# EAGLE design ProMini_İnişTakımı (EAGLE 9.6.2)
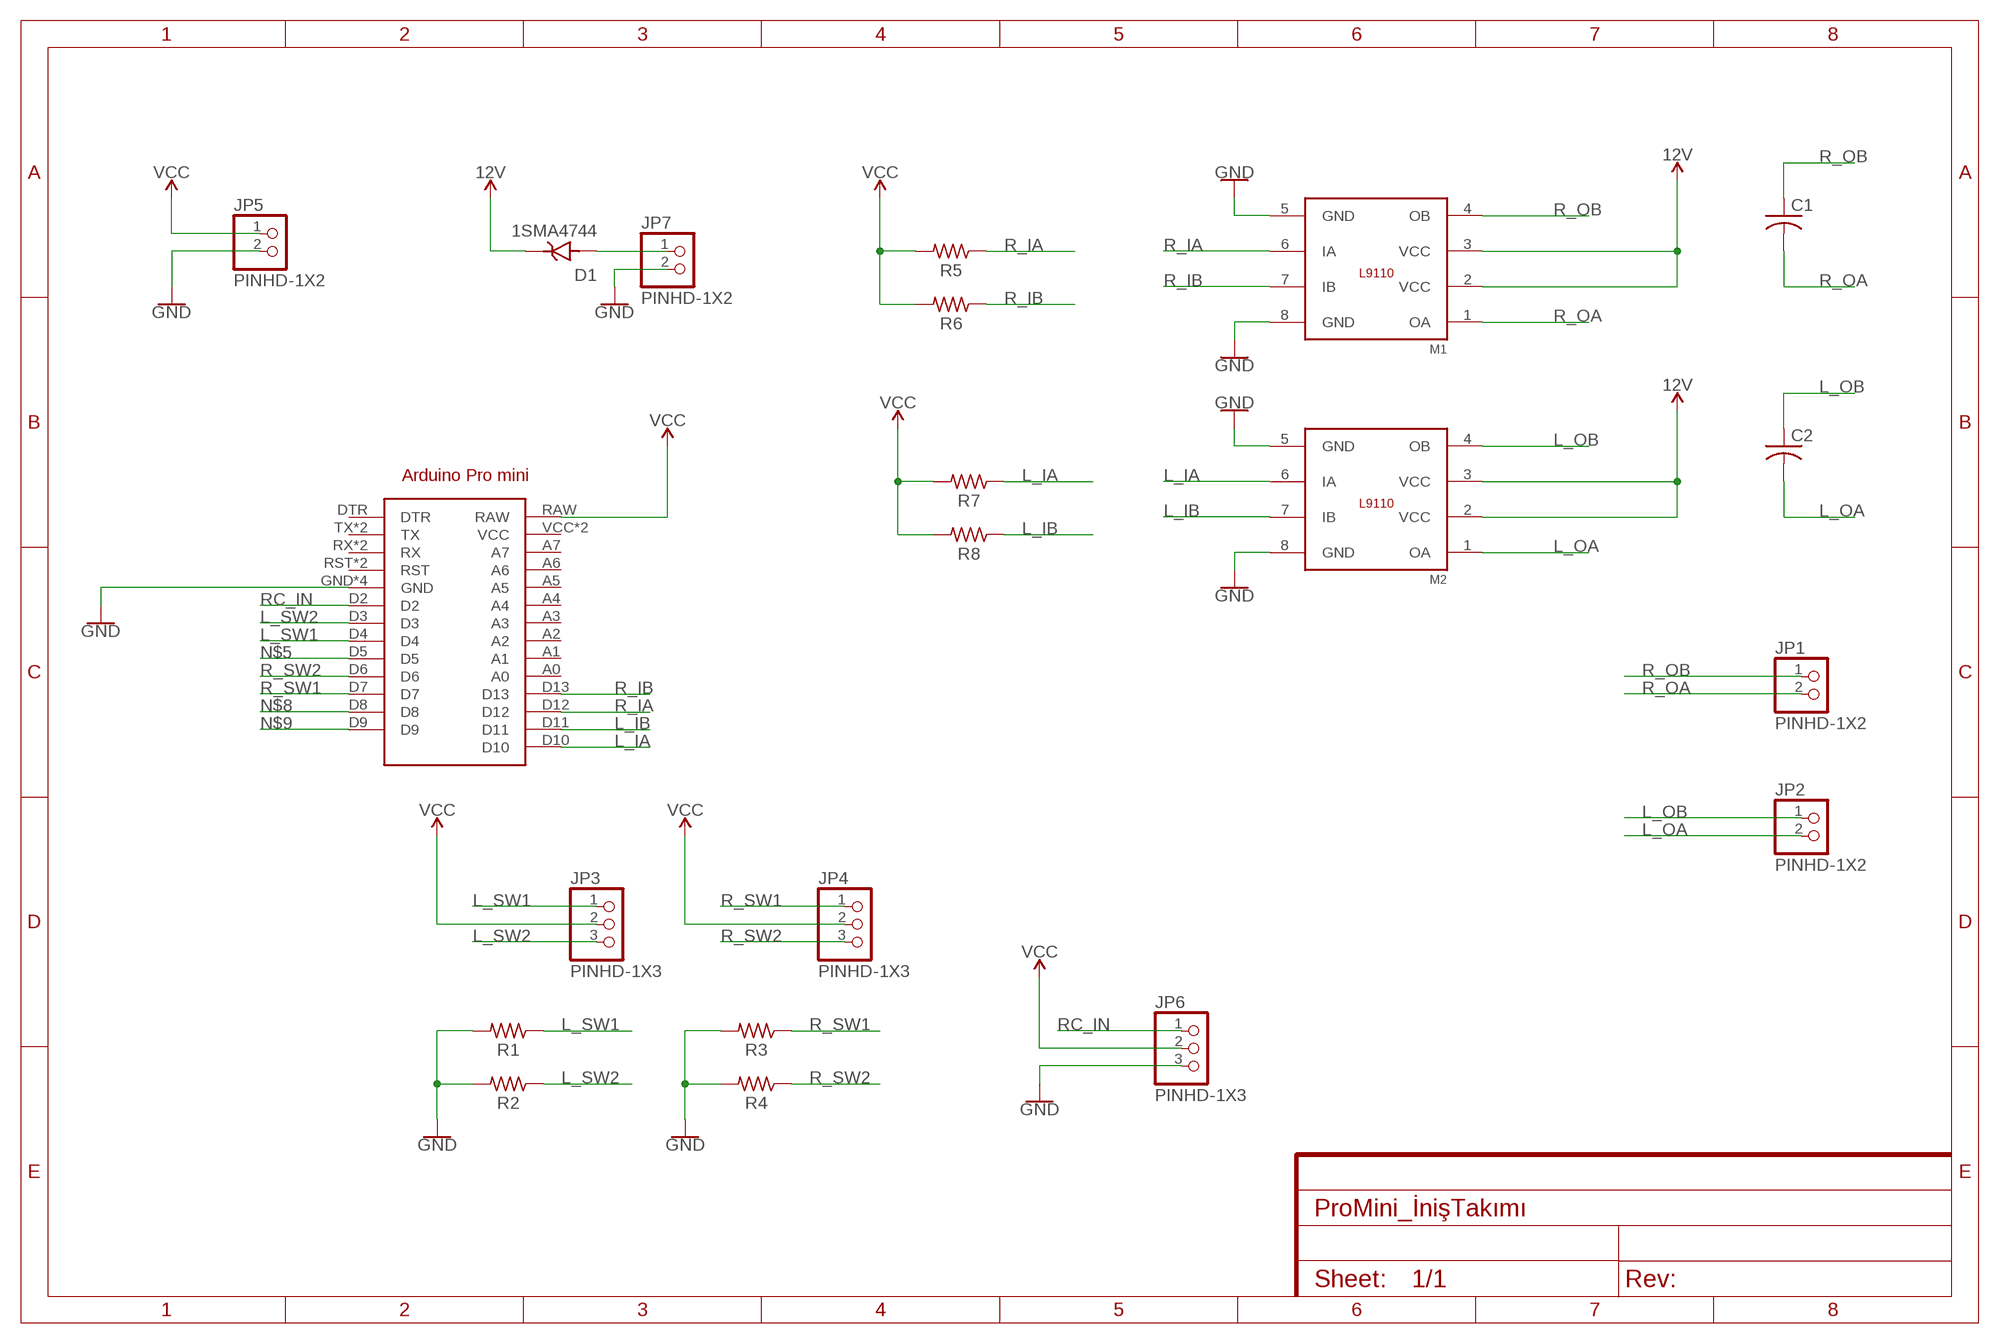
[diagram p0: schematic, sheet 1]

## Parts
ARDUINO1  ARDUINO_PRO_MINI  [ARDUINO_PRO_MINI]
C1  C-US_CHIP-0805(2012-METRIC)  [CAPC2012X110]
C2  C-US_CHIP-0805(2012-METRIC)  [CAPC2012X110]
D1  1SMA4744  [DIOM4325X250N]
JP1  PINHD-1X2  [1X02]
JP2  PINHD-1X2  [1X02]
JP3  PINHD-1X3  [1X03]
JP4  PINHD-1X3  [1X03]
JP5  PINHD-1X2  [1X02]
JP6  PINHD-1X3  [1X03]
JP7  PINHD-1X2  [1X02]
M1  L9110  [SO8P]
M2  L9110  [SO8P]
R1  R-US_CHIP-0805(2012-METRIC)  [RESC2012X65]
R2  R-US_CHIP-0805(2012-METRIC)  [RESC2012X65]
R3  R-US_CHIP-0805(2012-METRIC)  [RESC2012X65]
R4  R-US_CHIP-0805(2012-METRIC)  [RESC2012X65]
R5  R-US_CHIP-0805(2012-METRIC)  [RESC2012X65]
R6  R-US_CHIP-0805(2012-METRIC)  [RESC2012X65]
R7  R-US_CHIP-0805(2012-METRIC)  [RESC2012X65]
R8  R-US_CHIP-0805(2012-METRIC)  [RESC2012X65]

## Nets
12V: D1.C(K) M1.2(VCC) M1.3(VCC) M2.2(VCC) M2.3(VCC)
GND: ARDUINO1.GND ARDUINO1.GND@1(GND) ARDUINO1.GND@2(GND) ARDUINO1.GND@3(GND) JP5.2 JP6.3 JP7.2 M1.5(GND) M1.8(GND) M2.5(GND) M2.8(GND) R1.2 R2.2 R3.2 R4.2
L_IA: ARDUINO1.D10 M2.6(IA) R7.1
L_IB: ARDUINO1.D11 M2.7(IB) R8.1
L_OA: C2.2 JP2.2 M2.1(OA)
L_OB: C2.1 JP2.1 M2.4(OB)
L_SW1: ARDUINO1.D4 JP3.1 R1.1
L_SW2: ARDUINO1.D3 JP3.3 R2.1
N$1: D1.A JP7.1
N$5: ARDUINO1.D5
N$8: ARDUINO1.D8
N$9: ARDUINO1.D9
R_IA: ARDUINO1.D12 M1.6(IA) R5.1
R_IB: ARDUINO1.D13 M1.7(IB) R6.1
R_OA: C1.2 JP1.2 M1.1(OA)
R_OB: C1.1 JP1.1 M1.4(OB)
R_SW1: ARDUINO1.D7 JP4.1 R3.1
R_SW2: ARDUINO1.D6 JP4.3 R4.1
RC_IN: ARDUINO1.D2 JP6.1
VCC: ARDUINO1.RAW JP3.2 JP4.2 JP5.1 JP6.2 R5.2 R6.2 R7.2 R8.2
Unconnected: ARDUINO1.A0 ARDUINO1.A1 ARDUINO1.A2 ARDUINO1.A3 ARDUINO1.A4 ARDUINO1.A5 ARDUINO1.A6 ARDUINO1.A7 ARDUINO1.DTR ARDUINO1.RST ARDUINO1.RST@1(RST) ARDUINO1.RX ARDUINO1.RX@1(RX) ARDUINO1.TX ARDUINO1.TX@1(TX)

## Power pins joined to a net without a drawn wire
VCC: ARDUINO1.VCC ARDUINO1.VCC@1(VCC)

## Library data of the parts
ARDUINO1 = arduinopromini:ARDUINO_PRO_MINI: For creating Arduino Pro Mini shields
C1 C2 = Capacitor:C-US: Capacitor - ANSI; CATEGORY: Capacitor
D1 = 1SMA4744:1SMA4744: Check availability <https://pricing.snapeda.com/parts/1SMA4744/Taiwan%20Semiconductor/view-part?ref=eda>; AVAILABILITY: In Stock; DESCRIPTION: DO-214AC (SMA), 1250mW, 5%, Zener Diode; MF: Taiwan Semiconductor; MP: 1SMA4744; PACKAGE: SMA-2 Taiwan Semiconductor; PRICE: None; PURCHASE-URL: https://pricing.snapeda.com/search/part/1SMA4744/?ref=eda
JP1 JP2 JP5 JP7 = Connector:PINHD-1X2: PIN HEADER; CATEGORY: CONNECTOR; SUB-CATEGORY: PIN-HEADER
JP3 JP4 JP6 = Connector:PINHD-1X3: PIN HEADER; CATEGORY: CONNECTOR; SUB-CATEGORY: PIN-HEADER
M1 M2 = l9110:L9110
R1-R8 = Resistor:R-US: Resistor Fixed - ANSI; CATEGORY: Resistor; SUB-CATEGORY: Fixed

## Board
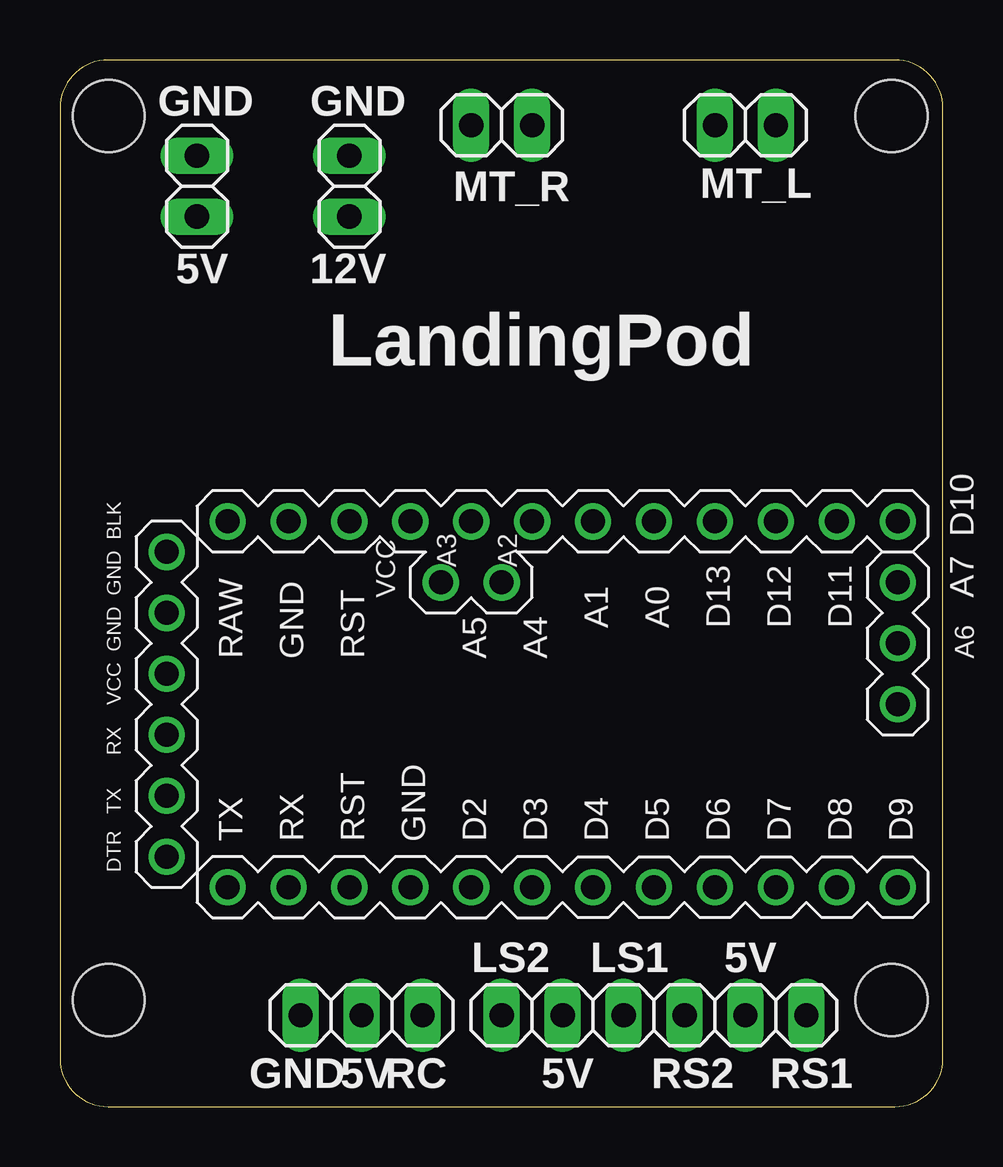
[diagram p1: board, top side]
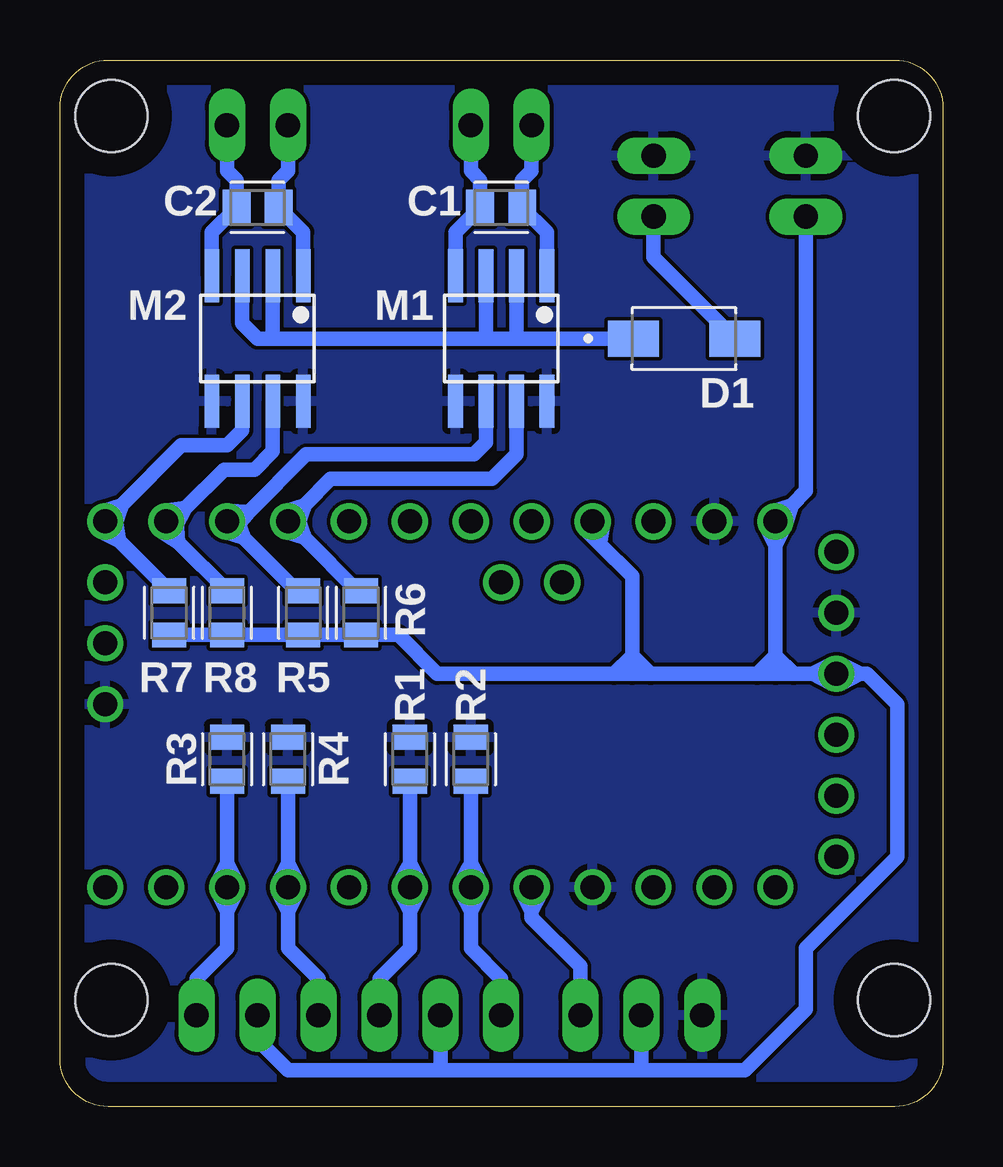
[diagram p2: board, bottom side, seen from below]

Size 36.81 x 43.61 mm. Coordinates in mm from the lower left corner, seen from the top.
Outline: 0,41.61 0,2 arc90 2,0 34.81,0 arc90 36.81,2 36.81,41.61 arc90 34.81,43.61 2,43.61 arc90 0,41.61
Copper layers (1*16): Top 0.035mm / dielectric 1.5mm / Bottom 0.035mm
Design rules "default": minimum track width 6mil, minimum drill 0.35mm, track to track 6mil, track to pad 6mil, pad to pad 6mil, via to via 6mil, smd to smd 6mil, copper to edge 40mil, drill to drill 6mil, minimum pad ring 10mil, minimum via ring 8mil, stop-mask expansion 4mil, vias tented up to drill 0mil, thermal gap 10mil
Holes 3 mm at 2.03,4.45 34.67,41.27 2.03,41.27 34.67,4.45

### Footprints (pad centres in the part's own frame; a part is rotated, then mirrored left to right if it is on the bottom)
ARDUINO_PRO_MINI = drill 1: A0 11.43,-8.89; A1 11.43,-6.35; A2 11.43,-3.81; A3 11.43,-1.27; A4 8.89,-2.54; A5 8.89,0; A6 6.35,-19.05; A7 8.89,-19.05; BLK 10.16,11.43; D2 -3.81,-1.27; D3 -3.81,-3.81; D4 -3.81,-6.35; D5 -3.81,-8.89; D6 -3.81,-11.43; D7 -3.81,-13.97; D8 -3.81,-16.51; D9 -3.81,-19.05; D10 11.43,-19.05; D11 11.43,-16.51; D12 11.43,-13.97; D13 11.43,-11.43; DTR -2.54,11.43; GND -3.81,1.27; GND@1 11.43,6.35; GND@2 7.62,11.43; GND@3 3.81,-19.05; RAW 11.43,8.89; RST 11.43,3.81; RST@1 -3.81,3.81; RX -3.81,6.35; RX@1 2.54,11.43; TX -3.81,8.89; TX@1 0,11.43; VCC 11.43,1.27; VCC@1 5.08,11.43
CAPC2012X110 = smd 1.165 x 1.465: 1 -0.875,0; 2 0.875,0
DIOM4325X250N = smd 2.12 x 1.5: A 2.115,0; C -2.115,0
1X02 = drill 1.016 long: 1 -1.27,0; 2 1.27,0
1X03 = drill 1.016 long: 1 -2.54,0; 2 0,0; 3 2.54,0
SO8P = smd 0.61 x 2.21: 1 -1.905,-2.616; 2 -0.635,-2.616; 3 0.635,-2.616; 4 1.905,-2.616; 5 1.905,2.616; 6 0.635,2.616; 7 -0.635,2.616; 8 -1.905,2.616
RESC2012X65 = smd 1.031 x 1.42: 1 -0.919,0; 2 0.919,0

### Placement (x,y rotation side)
ARDUINO1  15.88,12.95 90 top
C1  18.41,37.46 0 bottom
C2  28.58,37.46 0 bottom
D1  10.79,32 0 bottom
JP1  18.41,40.89 180 top
JP2  28.58,40.89 180 top
JP3  20.95,3.81 180 top
JP4  28.58,3.81 180 top
JP5  5.71,38.35 90 top
JP6  12.57,3.81 180 top
JP7  12.06,38.35 90 top
M1  18.41,32 180 bottom
M2  28.58,32 180 bottom
R1  22.22,14.48 90 bottom
R2  19.68,14.48 90 bottom
R3  29.84,14.48 90 bottom
R4  27.3,14.48 90 bottom
R5  26.67,20.57 270 bottom
R6  24.26,20.57 270 bottom
R7  32.26,20.57 270 bottom
R8  29.84,20.57 270 bottom

### Tracks (layer width: path | path; a pad name or v marks a point on that pad's centre or on a via)
12V
  Bottom 0.61: D1.C 17.78,32 | 17.78,32 19.18,32 | 19.18,32 27.94,32 | 27.94,32 28.58,32 29.21,32.64 M2.3 | M2.2 27.94,32 | M1.3 19.05,32.13 19.18,32 | M1.2 17.78,32
GND
  pour Bottom: 0.63,48.51 42.55,48.51 42.55,-6.1 -3.18,-6.1 -3.18,2.79 -3.18,48.51
L_IA
  Bottom 0.61: R7.1 34.34,23.57 | 34.34,23.57 34.92,24.16 ARDUINO1.D10 | ARDUINO1.D10 34.22,25.09 | 34.22,25.09 31.75,27.56 29.84,27.56 29.21,28.19 M2.6 | 34.34,23.57 35.13,23.99 ARDUINO1.D10 | 34.34,23.57 34.48,24.46 ARDUINO1.D10 | 34.22,25.09 34.5,24.24 ARDUINO1.D10 | 34.22,25.09 35.07,24.81 ARDUINO1.D10
L_IB
  Bottom 0.61: R8.1 31.88,23.52 | 31.88,23.52 32.38,24.03 ARDUINO1.D11 | ARDUINO1.D11 32.13,24.38 31.56,24.95 | 31.56,24.95 29.97,26.54 28.7,26.54 27.94,27.3 M2.7 | 31.88,23.52 32.63,24.01 ARDUINO1.D11 | 31.88,23.52 31.94,24.41 ARDUINO1.D11 | 31.56,24.95 31.99,24.17 ARDUINO1.D11 | 31.56,24.95 32.45,24.83 ARDUINO1.D11
L_OA
  Bottom 0.61: JP2.2 27.3,38.99 27.7,38.59 C2.2 26.67,36.44 M2.1
L_OB
  Bottom 0.61: JP2.1 29.84,38.99 29.45,38.59 C2.1 30.48,36.44 M2.4
L_SW1
  Bottom 0.61: R1.1 22.22,10.14 | 22.22,10.14 ARDUINO1.D4 | JP3.1 23.49,5.33 22.22,6.6 22.22,8.14 | 22.22,8.14 ARDUINO1.D4 | 22.22,10.14 21.82,9.35 ARDUINO1.D4 | 22.22,10.14 22.35,9.89 22.63,9.35 ARDUINO1.D4 | 22.22,8.14 22.63,8.94 ARDUINO1.D4 | 22.22,8.14 21.82,8.94 ARDUINO1.D4
L_SW2
  Bottom 0.61: R2.1 19.68,10.14 | 19.68,10.14 ARDUINO1.D3 | JP3.3 18.41,5.33 19.68,6.6 19.68,8.14 | 19.68,8.14 ARDUINO1.D3 | 19.68,10.14 19.28,9.35 ARDUINO1.D3 | 19.68,10.14 19.81,9.89 20.09,9.35 ARDUINO1.D3 | 19.68,8.14 20.09,8.94 ARDUINO1.D3 | 19.68,8.14 19.28,8.94 ARDUINO1.D3
N$1
  Bottom 0.61: D1.A 12.06,35.39 JP7.1
R_IA
  Bottom 0.61: R5.1 26.95,21.49 29.14,23.68 | 29.14,23.68 ARDUINO1.D12 | ARDUINO1.D12 29.34,24.38 28.93,24.79 | 28.93,24.79 26.54,27.18 19.56,27.18 19.05,27.69 M1.6 | 29.14,23.68 29.99,23.96 ARDUINO1.D12 | 29.14,23.68 29.42,24.52 ARDUINO1.D12 | 28.93,24.79 29.5,24.1 ARDUINO1.D12 | 28.93,24.79 29.82,24.83 ARDUINO1.D12
R_IB
  Bottom 0.61: R6.1 24.41,21.49 26.6,23.68 | 26.6,23.68 ARDUINO1.D13 | ARDUINO1.D13 26.6,25.09 | 26.6,25.09 25.53,26.16 18.8,26.16 17.78,27.18 M1.7 | 26.6,23.68 27.45,23.96 ARDUINO1.D13 | 26.6,23.68 26.88,24.52 ARDUINO1.D13 | 26.6,25.09 26.88,24.24 ARDUINO1.D13 | 26.6,25.09 27.45,24.81 ARDUINO1.D13
R_OA
  Bottom 0.61: M1.1 16.51,36.44 C1.2 17.54,38.59 17.14,38.99 JP1.2
R_OB
  Bottom 0.61: JP1.1 19.68,38.99 19.29,38.59 C1.1 20.32,36.44 M1.4
R_SW1
  Bottom 0.61: R3.1 29.84,10.14 | 29.84,10.14 ARDUINO1.D7 | JP4.1 31.11,5.33 29.84,6.6 29.84,8.14 | 29.84,8.14 ARDUINO1.D7 | 29.84,10.14 29.44,9.35 ARDUINO1.D7 | 29.84,10.14 29.97,9.89 30.25,9.35 ARDUINO1.D7 | 29.84,8.14 30.25,8.94 ARDUINO1.D7 | 29.84,8.14 29.44,8.94 ARDUINO1.D7
R_SW2
  Bottom 0.61: R4.1 27.3,10.14 | 27.3,10.14 ARDUINO1.D6 | JP4.3 26.03,5.33 27.3,6.6 27.3,8.14 | 27.3,8.14 ARDUINO1.D6 | 27.3,10.14 26.9,9.35 ARDUINO1.D6 | 27.3,10.14 27.43,9.89 27.71,9.35 ARDUINO1.D6 | 27.3,8.14 27.71,8.94 ARDUINO1.D6 | 27.3,8.14 26.9,8.94 ARDUINO1.D6
RC_IN
  Bottom 0.61: JP6.1 15.11,5.84 17.14,7.87 17.14,8.14 | 17.14,8.14 ARDUINO1.D2 | 17.14,8.14 17.55,8.94 ARDUINO1.D2 | 17.14,8.14 16.74,8.94 ARDUINO1.D2
VCC
  Bottom 0.61: ARDUINO1.VCC@1 5.44,18.03 | 5.44,18.03 6.22,18.03 | 6.22,18.03 6.98,18.03 | 6.98,18.03 7.75,18.03 | 7.75,18.03 12.19,18.03 | 12.19,18.03 12.95,18.03 | 12.95,18.03 13.72,18.03 | 13.72,18.03 21.08,18.03 22.7,19.66 R6.2 R5.2 R8.2 R7.2 | ARDUINO1.RAW 6.98,23.38 | 6.98,23.38 6.98,18.8 | 6.98,18.8 6.98,18.03 | 6.98,18.8 6.22,18.03 | 6.98,18.8 7.75,18.03 | ARDUINO1.VCC 14.6,23.75 14.29,23.44 | 14.29,23.44 12.95,22.1 12.95,18.8 | 12.95,18.8 12.95,18.03 | 12.19,18.03 12.95,18.8 | 12.95,18.8 13.72,18.03 | ARDUINO1.RAW 6.28,25.09 | 6.28,25.09 5.71,25.65 JP5.1 | ARDUINO1.VCC@1 3.44,18.03 | 3.44,18.03 3.17,18.03 1.9,16.76 1.9,10.41 5.71,6.6 5.71,4.06 8.25,1.52 12.57,1.52 | 12.57,1.52 20.95,1.52 | 20.95,1.52 27.3,1.52 28.58,2.79 JP4.2 | JP3.2 20.95,1.52 | JP6.2 12.57,1.52 | 14.29,23.44 14.92,24.07 ARDUINO1.VCC | 14.29,23.44 14.16,24.32 ARDUINO1.VCC | 5.44,18.03 4.65,18.44 ARDUINO1.VCC@1 | 5.44,18.03 4.65,17.63 ARDUINO1.VCC@1 | 3.44,18.03 4.24,17.63 ARDUINO1.VCC@1 | 3.44,18.03 4.24,18.44 ARDUINO1.VCC@1 | 6.98,23.38 7.39,24.18 ARDUINO1.RAW | 6.98,23.38 6.58,24.18 ARDUINO1.RAW | 6.28,25.09 6.56,24.24 ARDUINO1.RAW | 6.28,25.09 7.13,24.81 ARDUINO1.RAW

### Text on the board
tNames: GND | GND | MT_L | MT_R | 5V | 12V | LandingPod | LS2 | LS1 | 5V | RC | GND | 5V | 5V | RS2 | RS1